# Altium project teslapowermodule.PrjPcb
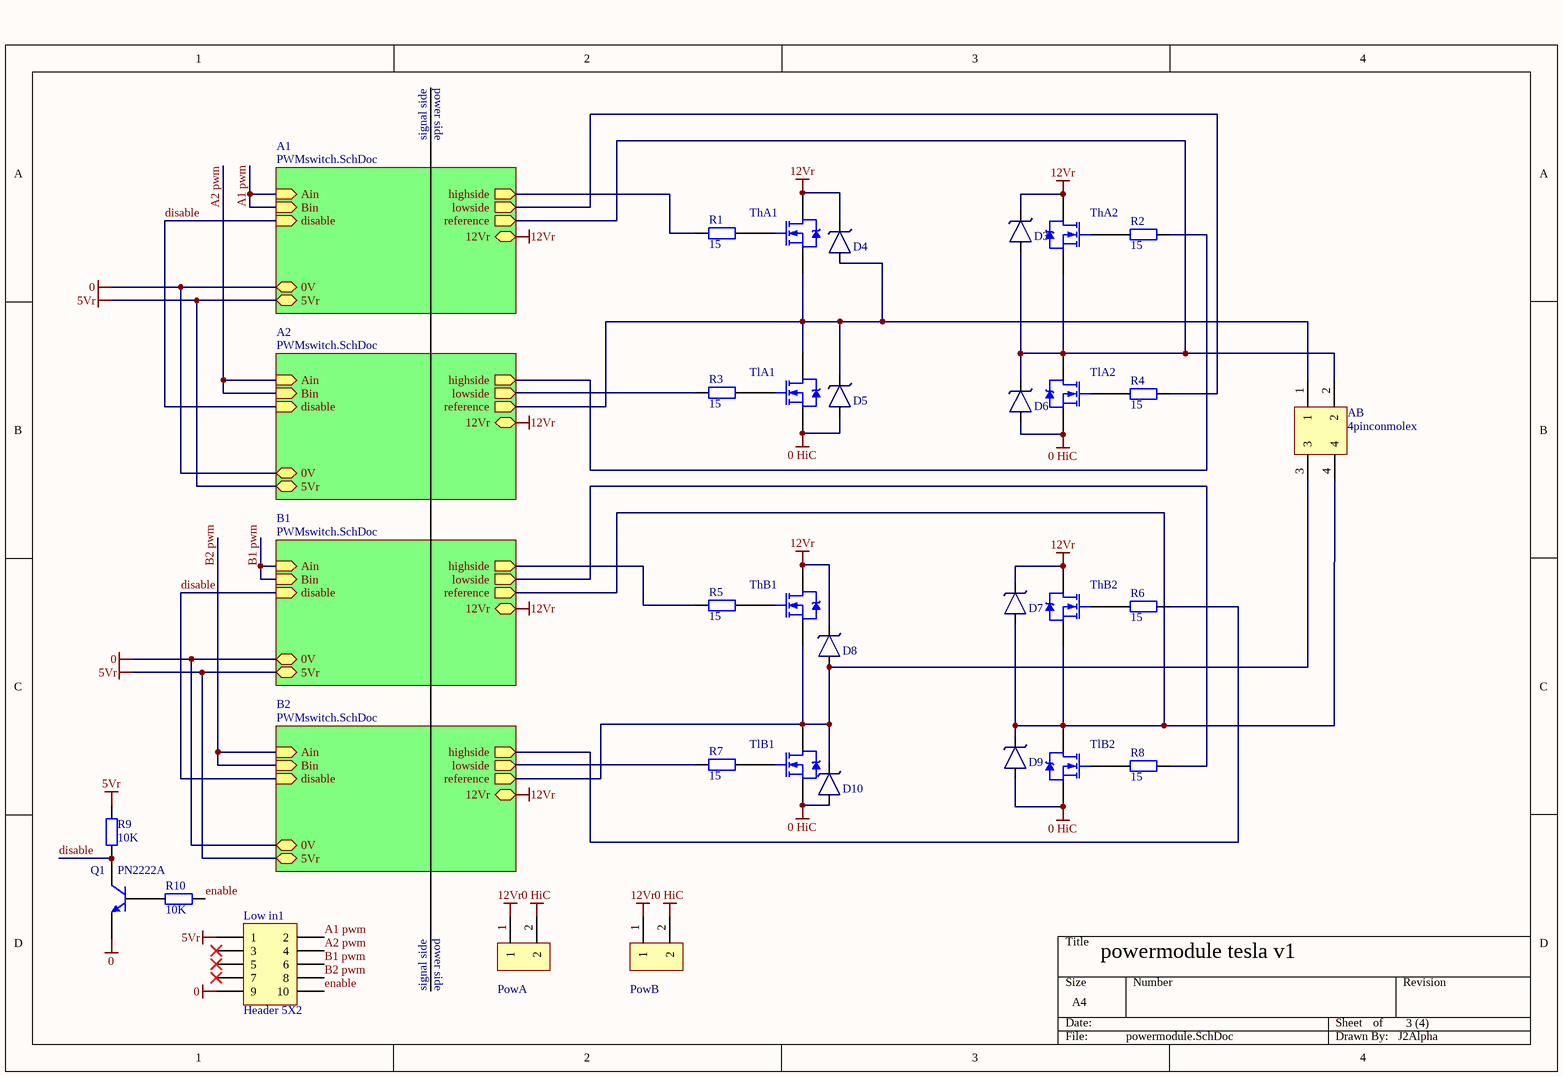
[diagram p0: powermodule.SchDoc]
2 sheets, 59 parts. Net scope: hierarchical (ports join the sheet entries above them; power ports are global).
Board file: powermodule.PcbDoc
Sheets:
  powermodule.SchDoc
    A1 = PWMswitch.SchDoc
    A2 = PWMswitch.SchDoc
    B1 = PWMswitch.SchDoc
    B2 = PWMswitch.SchDoc

## Sheet powermodule.SchDoc
size A4

### Parts
AB  4pinconmolex  [MOLEXmegafit2x2pin]
D3  tvs diode  [DSO-C2/X2.3]  (value not drawn)
D4  tvs diode  [DSO-C2/X2.3]  (value not drawn)
D5  tvs diode  [DSO-C2/X2.3]  (value not drawn)
D6  tvs diode  [DSO-C2/X2.3]  (value not drawn)
D7  tvs diode  [DSO-C2/X2.3]  (value not drawn)
D8  tvs diode  [DSO-C2/X2.3]  (value not drawn)
D9  tvs diode  [DSO-C2/X2.3]  (value not drawn)
D10  tvs diode  [DSO-C2/X2.3]  (value not drawn)
Low_in1  Header 5X2  [HDR2X5]
PowA  p2hic  [pin2pitch6.35mmL]  (value not drawn)
PowB  p2hic  [pin2pitch6.35mmL]  (value not drawn)
Q1  PN2222A  [SOT23-3N]
R1  15  [1005[0402]]
R2  15  [1005[0402]]
R3  15  [1005[0402]]
R4  15  [1005[0402]]
R5  15  [1005[0402]]
R6  15  [1005[0402]]
R7  15  [1005[0402]]
R8  15  [1005[0402]]
R9  10K  [1005[0402]]
R10  10K  [1608[0603]]
ThA1  STM nmos transistor  [T0220 heatsinked]  (value not drawn)
ThA2  STM nmos transistor  [T0220 heatsinked]  (value not drawn)
ThB1  STM nmos transistor  [T0220 heatsinked]  (value not drawn)
ThB2  STM nmos transistor  [T0220 heatsinked]  (value not drawn)
TlA1  STM nmos transistor  [T0220 heatsinked]  (value not drawn)
TlA2  STM nmos transistor  [T0220 heatsinked]  (value not drawn)
TlB1  STM nmos transistor  [T0220 heatsinked]  (value not drawn)
TlB2  STM nmos transistor  [T0220 heatsinked]  (value not drawn)

### Sub-sheets
A1 = PWMswitch.SchDoc: Ain (in), Bin (in), disable (in), highside (out), lowside (out), reference (out), 12Vr, 0V, 5Vr
A2 = PWMswitch.SchDoc: Ain (in), Bin (in), disable (in), highside (out), lowside (out), reference (out), 12Vr, 0V, 5Vr
B1 = PWMswitch.SchDoc: Ain (in), Bin (in), disable (in), highside (out), lowside (out), reference (out), 12Vr, 0V, 5Vr
B2 = PWMswitch.SchDoc: Ain (in), Bin (in), disable (in), highside (out), lowside (out), reference (out), 12Vr, 0V, 5Vr

### Nets
0: Low_in1.9 Q1.1(E) ; sheet A1/0V, sheet A2/0V, sheet B1/0V, sheet B2/0V
0 HiC: D5.1 D6.1 D9.1 D10.1 PowA.2 PowB.2 TlA1.3(S) TlA2.3(S) TlB1.3(S) TlB2.3(S)
5Vr: Low_in1.1 R9.2 ; sheet A1/5Vr, sheet A2/5Vr, sheet B1/5Vr, sheet B2/5Vr
12Vr: D3.2 D4.2 D7.2 D8.2 PowA.1 PowB.1 ThA1.2(D) ThA2.2(D) ThB1.2(D) ThB2.2(D) ; sheet A1/12Vr, sheet A2/12Vr, sheet B1/12Vr, sheet B2/12Vr
A1 pwm: Low_in1.2 ; sheet A1/Ain, sheet A1/Bin
A2 pwm: Low_in1.4 ; sheet A2/Ain, sheet A2/Bin
B1 pwm: Low_in1.6 ; sheet B1/Ain, sheet B1/Bin
B2 pwm: Low_in1.8 ; sheet B2/Ain, sheet B2/Bin
disable: Q1.3(C) R9.1 ; sheet A1/disable, sheet A2/disable, sheet B1/disable, sheet B2/disable
enable: Low_in1.10 R10.1
floatingref: AB.1 D4.1 D5.2 ThA1.3(S) TlA1.2(D) ; sheet A2/reference
floatingref: AB.2 D3.1 D6.2 ThA2.3(S) TlA2.2(D) ; sheet A1/reference  [a separate net that carries the same name]
floatingref: AB.3 D8.1 D10.2 ThB1.3(S) TlB1.2(D) ; sheet B2/reference  [a separate net that carries the same name]
floatingref: AB.4 D7.1 D9.2 ThB2.3(S) TlB2.2(D) ; sheet B1/reference  [a separate net that carries the same name]
NetQ1_2: Q1.2(B) R10.2
NetR1_1: R1.1 ThA1.1(G)
NetR1_2: R1.2 ; sheet A1/highside
NetR2_1: R2.1 ; sheet A2/highside
NetR2_2: R2.2 ThA2.1(G)
NetR3_1: R3.1 TlA1.1(G)
NetR3_2: R3.2 ; sheet A2/lowside
NetR4_1: R4.1 ; sheet A1/lowside
NetR4_2: R4.2 TlA2.1(G)
NetR5_1: R5.1 ThB1.1(G)
NetR5_2: R5.2 ; sheet B1/highside
NetR6_1: R6.1 ; sheet B2/highside
NetR6_2: R6.2 ThB2.1(G)
NetR7_1: R7.1 TlB1.1(G)
NetR7_2: R7.2 ; sheet B2/lowside
NetR8_1: R8.1 ; sheet B1/lowside
NetR8_2: R8.2 TlB2.1(G)

Not connected (* = marked no-connect by the designer): Low_in1 3* 5* 7*

### Notes on the sheet
- power side
- signal side
- powermodule tesla v1
- 3 (4)
- J2Alpha

### Library data of the parts
D3-D10 = tvsdiode: tvs diode fast 100A 160V; mfg: Vishay; Mouser: 625-P6SMB160A-E3/52
Low_in1 = Header 5X2: Header, 5-Pin, Dual row; LatestRevisionDate: 17-Jul-2002; LatestRevisionNote: Re-released for DXP Platform.; Publisher: Altium Limited
PowA PowB = p2hic: 2 terminal 5mm pitch screw terminal; manufacturer: phoenix contact; pitch: 6.53mm; optimal wire size: 2.5mm² (awg 14-22); nominal current: 32A; nominal voltage: 500V; Mouser partnumber: 651-1714955
Q1 = PN2222A: NPN General Purpose Amplifier; Published: 8-Jun-2000; LatestRevisionDate: 17-Jan-2003; LatestRevisionNote: PCB Footprint 'BCY-W3/D4.7' replaced; DatasheetDocument: 1997; PackageDocument: Sep-1998; PackageReference: TO-92A; Publisher: Altium Limited; ComponentLink1Description: Manufacturer Link; ComponentLink1URL: http://www.fairchildsemi.com/; ComponentLink2Description: Discontinuation Notice; ComponentLink2URL: http://www.fairchildsemi.com/obsolete/obs.jsp
R1-R10 = Res_mm: Resistor; Published: 8-Jun-2000; LatestRevisionDate: 17-Jul-2002; LatestRevisionNote: Re-released for DXP Platform.; PackageReference: AXIAL-0.4; Publisher: Altium Limited; Farnell code: *
  R1-R8: Value: 15
  R9 R10: Value: 10K
ThA1 ThB1 ThB2 TlA1 TlA2 TlB1 TlB2 = STM nmos transistor: MOSFET N-CH 600V 0.078Ohm typ. 34A MDmesh II; mfg partnumber: STP40N60M2; mouser partnumber: 511-STP40N60M2
ThA2 = STM nmos transistor: MOSFET N-CH 600V 0.078Ohm typ. 34A MDmesh II; mfg partnumber: STP40N60M2; heatsink partnumber  (optional): 567-272-AB; mouser partnumber: 511-STP40N60M2
AB = 4pinconmolex: Mouser Partnumber: 538-172065-0004

## Sheet PWMswitch.SchDoc
size A4
Used 4 times, as channels A1, A2, B1, B2. Parts and nets are listed once, with the designators drawn on the sheet.
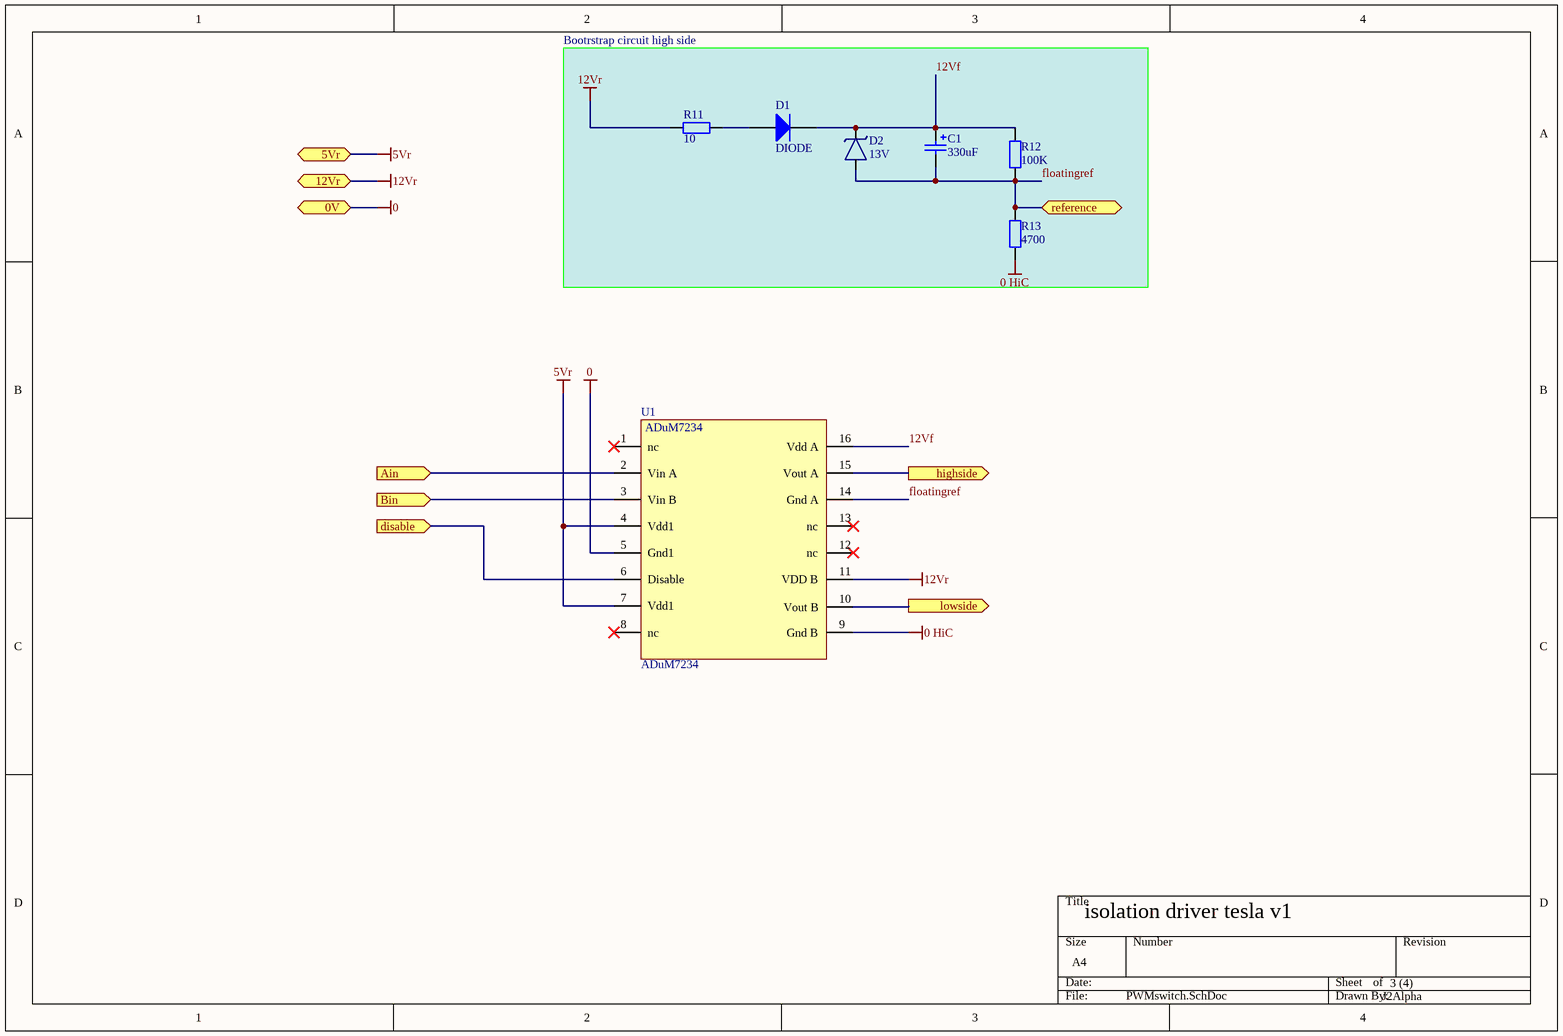
[diagram p1: PWMswitch.SchDoc]

### Parts
C1  330uF  [1608[0603]]
D1  DIODE  [SMB]
D2  13V  [SOT95P240-3N]
R11  10  [1005[0402]]
R12  100K  [1005[0402]]
R13  4700  [1005[0402]]
U1  ADuM7234  [SOIC127P600-16N]

### Blocks framed on the sheet
Bootrstrap circuit high side: C1 D1 D2 R11-R13

### Ports
0V, 5Vr, 12Vr, Ain (in), Bin (in), disable (in), highside (out), lowside (out), reference

### Nets
0: U1.5(Gnd1) ; port 0V
0 HiC: R13.1 U1.9(Gnd_B)
5Vr: U1.4(Vdd1) U1.7(Vdd1) ; port 5Vr
12Vr: R11.1 U1.11(VDD_B) ; port 12Vr
12Vf: C1.1 D1.K D2.3 R12.2 U1.16(Vdd_A)
Ain: U1.2(Vin_A) ; port Ain
Bin: U1.3(Vin_B) ; port Bin
disable: U1.6(Disable) ; port disable
floatingref: C1.2 D2.1 R12.1 R13.2 U1.14(Gnd_A) ; port reference
highside: U1.15(Vout_A) ; port highside
lowside: U1.10(Vout_B) ; port lowside
NetD1_A: D1.A R11.2

Not connected (* = marked no-connect by the designer): D2 2; U1 1(nc)* 8(nc)* 12(nc)* 13(nc)*

### Channels
A1: designators end in _A1; ports 0V=0 5Vr=5Vr 12Vr=12Vr Ain=A1 pwm Bin=A1 pwm disable=disable highside=NetR1_2 lowside=NetR4_1 reference=floatingref
A2: designators end in _A2; ports 0V=0 5Vr=5Vr 12Vr=12Vr Ain=A2 pwm Bin=A2 pwm disable=disable highside=NetR2_1 lowside=NetR3_2 reference=floatingref
B1: designators end in _B1; ports 0V=0 5Vr=5Vr 12Vr=12Vr Ain=B1 pwm Bin=B1 pwm disable=disable highside=NetR5_2 lowside=NetR8_1 reference=floatingref
B2: designators end in _B2; ports 0V=0 5Vr=5Vr 12Vr=12Vr Ain=B2 pwm Bin=B2 pwm disable=disable highside=NetR6_1 lowside=NetR7_2 reference=floatingref

### Notes on the sheet
- isolation driver tesla v1
- 3 (4)
- J2Alpha

### Library data of the parts
C1 = Cap_pol_mm: Capacitor polorized; Published: 8-Jun-2000; LatestRevisionDate: 17-Jul-2002; LatestRevisionNote: Re-released for DXP Platform.; PackageReference: RAD-0.3; Publisher: Altium Limited; Farnell code: *; Value: 330uF
D1 = DIODE: regular diode; farnell code: 1467550
D2 = zennerdiode sot23: Zener; Value: 13V
R11-R13 = Res_mm: Resistor; Published: 8-Jun-2000; LatestRevisionDate: 17-Jul-2002; LatestRevisionNote: Re-released for DXP Platform.; PackageReference: AXIAL-0.4; Publisher: Altium Limited; Farnell code: *
  R11: Value: 10; Mouser: 667-ERJ-XGNJ100Y
  R12: Value: 100K; Mouser: 660-RK73B1FTTBL104J
  R13: Value: 4700; Mouser: 667-ERJ-XGNJ472Y
U1 = ADuM7234: ADuM7234 dual isolated gate driver; Mouser: 584-ADUM7234BRZ

## Nets that join several sheets
0: powermodule (Low_in1.9 Q1.1), A1 (U1_A1.5), A2 (U1_A2.5), B1 (U1_B1.5), B2 (U1_B2.5)
0 HiC: powermodule (10 pins), A1 (R13_A1.1 U1_A1.9), A2 (R13_A2.1 U1_A2.9), B1 (R13_B1.1 U1_B1.9), B2 (R13_B2.1 U1_B2.9)
5Vr: powermodule (Low_in1.1 R9.2), A1 (U1_A1.4 U1_A1.7), A2 (U1_A2.4 U1_A2.7), B1 (U1_B1.4 U1_B1.7), B2 (U1_B2.4 U1_B2.7)
12Vr: powermodule (10 pins), A1 (R11_A1.1 U1_A1.11), A2 (R11_A2.1 U1_A2.11), B1 (R11_B1.1 U1_B1.11), B2 (R11_B2.1 U1_B2.11)
A1 pwm: powermodule (Low_in1.2), A1 (U1_A1.2 U1_A1.3)
A2 pwm: powermodule (Low_in1.4), A2 (U1_A2.2 U1_A2.3)
B1 pwm: powermodule (Low_in1.6), B1 (U1_B1.2 U1_B1.3)
B2 pwm: powermodule (Low_in1.8), B2 (U1_B2.2 U1_B2.3)
disable: powermodule (Q1.3 R9.1), A1 (U1_A1.6), A2 (U1_A2.6), B1 (U1_B1.6), B2 (U1_B2.6)
floatingref: powermodule (5 pins), A2 (5 pins)
floatingref: powermodule (5 pins), A1 (5 pins)
floatingref: powermodule (5 pins), B2 (5 pins)
floatingref: powermodule (5 pins), B1 (5 pins)
NetR1_2: powermodule (R1.2), A1 (U1_A1.15)
NetR2_1: powermodule (R2.1), A2 (U1_A2.15)
NetR3_2: powermodule (R3.2), A2 (U1_A2.10)
NetR4_1: powermodule (R4.1), A1 (U1_A1.10)
NetR5_2: powermodule (R5.2), B1 (U1_B1.15)
NetR6_1: powermodule (R6.1), B2 (U1_B2.15)
NetR7_2: powermodule (R7.2), B2 (U1_B2.10)
NetR8_1: powermodule (R8.1), B1 (U1_B1.10)